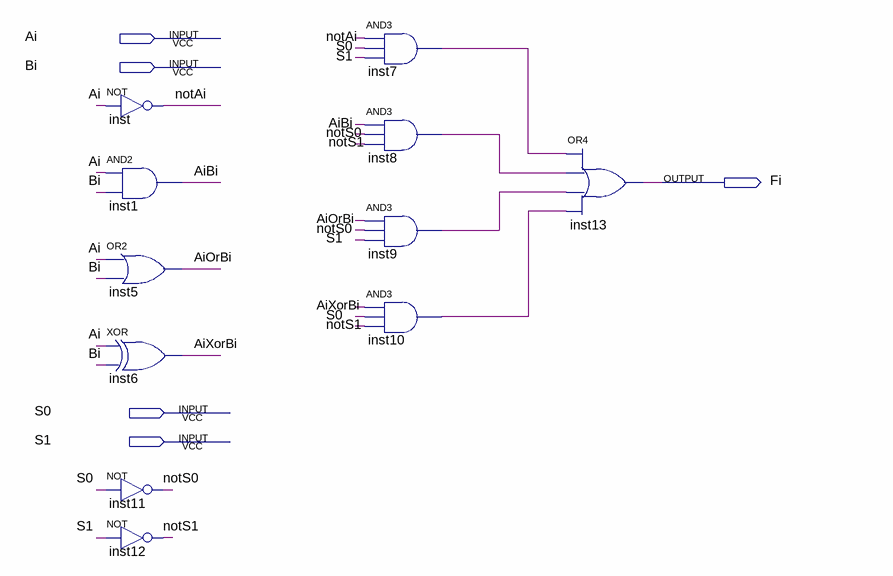
[diagram p0: schematic sheet]
// Quartus schematic log1.bdf as structural Verilog: 11 symbols, 5 pins
module log1 (
  input  Ai,
  input  Bi,
  input  S0,
  input  S1,
  output Fi
);

  wire AiBi, AiOrBi, AiXorBi, inst7_out, inst8_out, inst9_out, inst10_out, notAi, notS0, notS1;

  not inst (notAi, Ai);
  and inst1 (AiBi, Ai, Bi);
  or inst5 (AiOrBi, Ai, Bi);
  xor inst6 (AiXorBi, Ai, Bi);
  not inst11 (notS0, S0);
  not inst12 (notS1, S1);
  and inst7 (inst7_out, notAi, S0, S1);
  and inst8 (inst8_out, AiBi, notS0, notS1);
  and inst9 (inst9_out, AiOrBi, notS0, S1);
  and inst10 (inst10_out, AiXorBi, S0, notS1);
  or inst13 (Fi, inst7_out, inst8_out, inst9_out, inst10_out);
endmodule
